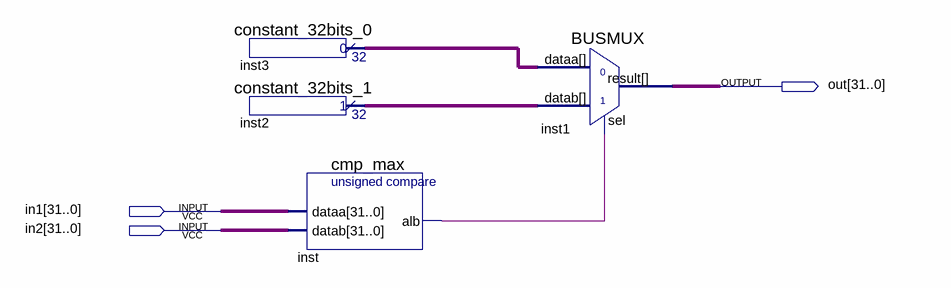
[diagram p0: schematic sheet]
// Quartus schematic slt.bdf as structural Verilog: 4 symbols, 3 pins
module slt (
  input  [31:0] in1,
  input  [31:0] in2,
  output [31:0] out
);

  wire inst_alb;
  wire [31:0] inst2_result, inst3_result;

  constant_32bits_0 inst3 (.result(inst3_result));
  constant_32bits_1 inst2 (.result(inst2_result));
  cmp_max inst (.dataa(in1), .datab(in2), .alb(inst_alb));
  BUSMUX inst1 (.datab(inst2_result), .sel(inst_alb), .dataa(inst3_result), .result(out));
endmodule
